# EAGLE schematic xio2 (EAGLE 9.2.2), part 2 of 2
## Sheet 16 of 19: FPGA Bank 14
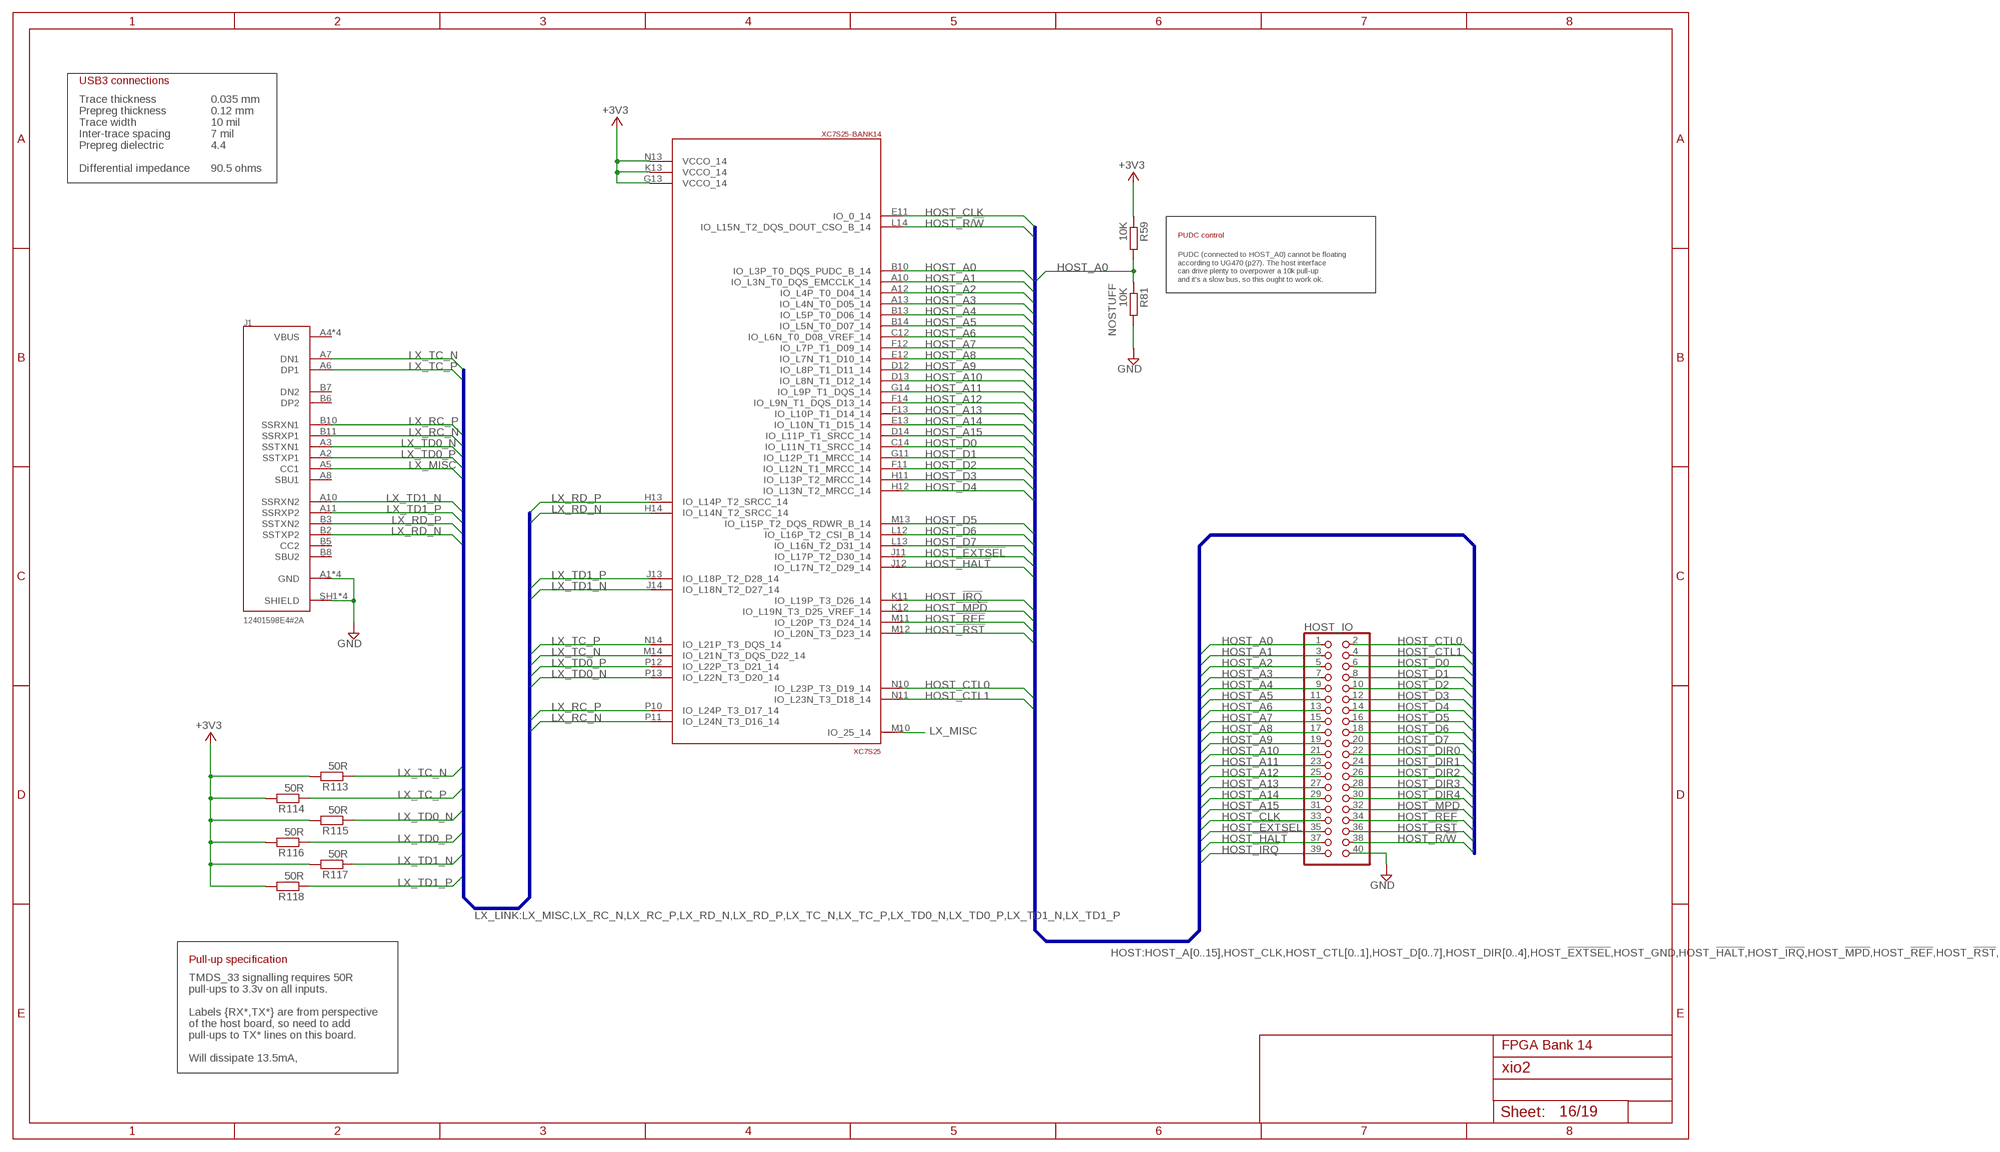
[diagram p15: schematic, sheet 16]

### Parts
HOST_IO  PINHD-2X20/90  [2X20/90]
J1  12401598E4#2A  [AMPHENOL_12401598E4#2A]
R59  10K  R-EU_R0201  [R0201]
R81  10K  R-EU_R0201  [R0201]
R113  50R  R-EU_R0201  [R0201]
R114  50R  R-EU_R0201  [R0201]
R115  50R  R-EU_R0201  [R0201]
R116  50R  R-EU_R0201  [R0201]
R117  50R  R-EU_R0201  [R0201]
R118  50R  R-EU_R0201  [R0201]

### Nets
+3V3 [lcd]: R59.1 R113.2 R114.2 R115.2 R116.2 R117.2 R118.2 XC7S25.G13(-BANK14:VCCO_14) XC7S25.K13(-BANK14:VCCO_14) XC7S25.N13(-BANK14:VCCO_14) ; also sheet 2,4,5,6,7,9,10,11,12,13,14,15,17,18,19
GND: HOST_IO.40 J1.A1(GND) J1.A12(GND) J1.B1(GND) J1.B12(GND) J1.SH1(SHIELD) J1.SH2(SHIELD) J1.SH3(SHIELD) J1.SH4(SHIELD) R81.2 ; also sheet 2,4,5,6,7,8,9,10,11,12,13,14,15,17,18,19
HOST_!EXTSEL!: HOST_IO.35 XC7S25.J11(-BANK14:IO_L17P_T2_D30_14) ; also sheet 10,11,12
HOST_!HALT!: HOST_IO.37 XC7S25.J12(-BANK14:IO_L17N_T2_D29_14) ; also sheet 10,11,12
HOST_!IRQ!: HOST_IO.39 XC7S25.K11(-BANK14:IO_L19P_T3_D26_14) ; also sheet 10,11,12
HOST_!MPD!: HOST_IO.32 XC7S25.K12(-BANK14:IO_L19N_T3_D25_VREF_14) ; also sheet 10,11,12
HOST_!REF!: HOST_IO.34 XC7S25.M11(-BANK14:IO_L20P_T3_D24_14) ; also sheet 10,11,12
HOST_!RST!: HOST_IO.36 XC7S25.M12(-BANK14:IO_L20N_T3_D23_14) ; also sheet 10,11,12
HOST_A0: HOST_IO.1 R59.2 R81.1 XC7S25.B10(-BANK14:IO_L3P_T0_DQS_PUDC_B_14) ; also sheet 3,10,11,12,18
HOST_A1: HOST_IO.3 XC7S25.A10(-BANK14:IO_L3N_T0_DQS_EMCCLK_14) ; also sheet 3,10,11,12,18
HOST_A2: HOST_IO.5 XC7S25.A12(-BANK14:IO_L4P_T0_D04_14) ; also sheet 3,10,11,12,18
HOST_A3: HOST_IO.7 XC7S25.A13(-BANK14:IO_L4N_T0_D05_14) ; also sheet 3,10,11,12,18
HOST_A4: HOST_IO.9 XC7S25.B13(-BANK14:IO_L5P_T0_D06_14) ; also sheet 3,10,11,12,18
HOST_A5: HOST_IO.11 XC7S25.B14(-BANK14:IO_L5N_T0_D07_14) ; also sheet 3,10,11,12,18
HOST_A6: HOST_IO.13 XC7S25.C12(-BANK14:IO_L6N_T0_D08_VREF_14) ; also sheet 3,10,11,12,18
HOST_A7: HOST_IO.15 XC7S25.F12(-BANK14:IO_L7P_T1_D09_14) ; also sheet 3,10,11,12,18
HOST_A8: HOST_IO.17 XC7S25.E12(-BANK14:IO_L7N_T1_D10_14) ; also sheet 3,10,11,12,18
HOST_A9: HOST_IO.19 XC7S25.D12(-BANK14:IO_L8P_T1_D11_14) ; also sheet 3,10,11,12,18
HOST_A10: HOST_IO.21 XC7S25.D13(-BANK14:IO_L8N_T1_D12_14) ; also sheet 3,10,11,12,18
HOST_A11: HOST_IO.23 XC7S25.G14(-BANK14:IO_L9P_T1_DQS_14) ; also sheet 3,10,11,12,18
HOST_A12: HOST_IO.25 XC7S25.F14(-BANK14:IO_L9N_T1_DQS_D13_14) ; also sheet 3,10,11,12,18
HOST_A13: HOST_IO.27 XC7S25.F13(-BANK14:IO_L10P_T1_D14_14) ; also sheet 3,10,11,12
HOST_A14: HOST_IO.29 XC7S25.E13(-BANK14:IO_L10N_T1_D15_14) ; also sheet 3,10,11,12
HOST_A15: HOST_IO.31 XC7S25.D14(-BANK14:IO_L11P_T1_SRCC_14) ; also sheet 3,10,11,12
HOST_CLK: HOST_IO.33 XC7S25.E11(-BANK14:IO_0_14) ; also sheet 10,11,12,18
HOST_CTL0: HOST_IO.2 XC7S25.N10(-BANK14:IO_L23P_T3_D19_14)
HOST_CTL1: HOST_IO.4 XC7S25.N11(-BANK14:IO_L23N_T3_D18_14)
HOST_D0: HOST_IO.6 XC7S25.C14(-BANK14:IO_L11N_T1_SRCC_14) ; also sheet 10,11,12,18
HOST_D1: HOST_IO.8 XC7S25.G11(-BANK14:IO_L12P_T1_MRCC_14) ; also sheet 10,11,12,18
HOST_D2: HOST_IO.10 XC7S25.F11(-BANK14:IO_L12N_T1_MRCC_14) ; also sheet 10,11,12,18
HOST_D3: HOST_IO.12 XC7S25.H11(-BANK14:IO_L13P_T2_MRCC_14) ; also sheet 10,11,12,18
HOST_D4: HOST_IO.14 XC7S25.H12(-BANK14:IO_L13N_T2_MRCC_14) ; also sheet 10,11,12,18
HOST_D5: HOST_IO.16 XC7S25.M13(-BANK14:IO_L15P_T2_DQS_RDWR_B_14) ; also sheet 10,11,12,18
HOST_D6: HOST_IO.18 XC7S25.L12(-BANK14:IO_L16P_T2_CSI_B_14) ; also sheet 10,11,12,18
HOST_D7: HOST_IO.20 XC7S25.L13(-BANK14:IO_L16N_T2_D31_14) ; also sheet 10,11,12,18
HOST_DIR0: HOST_IO.22 ; also sheet 17,18
HOST_DIR1: HOST_IO.24 ; also sheet 17
HOST_DIR2: HOST_IO.26 ; also sheet 17
HOST_DIR3: HOST_IO.28 ; also sheet 17
HOST_DIR4: HOST_IO.30 ; also sheet 17
HOST_R/!W!: HOST_IO.38 XC7S25.L14(-BANK14:IO_L15N_T2_DQS_DOUT_CSO_B_14) ; also sheet 10,11,12,18
LX_MISC: J1.A5(CC1) XC7S25.M10(-BANK14:IO_25_14)
LX_RC_N [usb90]: J1.B11(SSRXP1) XC7S25.P11(-BANK14:IO_L24N_T3_D16_14)
LX_RC_P [usb90]: J1.B10(SSRXN1) XC7S25.P10(-BANK14:IO_L24P_T3_D17_14)
LX_RD_N [usb90]: J1.B2(SSTXP2) XC7S25.H14(-BANK14:IO_L14N_T2_SRCC_14)
LX_RD_P [usb90]: J1.B3(SSTXN2) XC7S25.H13(-BANK14:IO_L14P_T2_SRCC_14)
LX_TC_N [usb90]: J1.A7(DN1) R113.1 XC7S25.M14(-BANK14:IO_L21N_T3_DQS_D22_14)
LX_TC_P [usb90]: J1.A6(DP1) R114.1 XC7S25.N14(-BANK14:IO_L21P_T3_DQS_14)
LX_TD0_N [usb90]: J1.A3(SSTXN1) R115.1 XC7S25.P13(-BANK14:IO_L22N_T3_D20_14)
LX_TD0_P [usb90]: J1.A2(SSTXP1) R116.1 XC7S25.P12(-BANK14:IO_L22P_T3_D21_14)
LX_TD1_N [usb90]: J1.A10(SSRXN2) R117.1 XC7S25.J14(-BANK14:IO_L18N_T2_D27_14)
LX_TD1_P [usb90]: J1.A11(SSRXP2) R118.1 XC7S25.J13(-BANK14:IO_L18P_T2_D28_14)
Unconnected: J1.A4(VBUS) J1.A8(SBU1) J1.A9(VBUS) J1.B4(VBUS) J1.B5(CC2) J1.B6(DP2) J1.B7(DN2) J1.B8(SBU2) J1.B9(VBUS)

### Buses
LX_LINK:LX_MISC,LX_RC_N,LX_RC_P,LX_RD_N,LX_RD_P,LX_TC_N,LX_TC_P,LX_TD0_N,LX_TD0_P,LX_TD1_N,LX_TD1_P
LX_RC_N,LX_RC_P,LX_RD_N,LX_RD_P,LX_TC_N,LX_TC_P,LX_TD0_N,LX_TD0_P,LX_TD1_N,LX_TD1_P
HOST:HOST_A[0..15],HOST_CLK,HOST_CTL[0..1],HOST_D[0..7],HOST_DIR[0..4],HOST_!EXTSEL!,HOST_GND,HOST_!HALT!,HOST_!IRQ!,HOST_!MPD!,HOST_!REF!,HOST_!RST!,HOST_R/!W!

### Notes on the sheet
- USB3 connections
- Trace thickness
  Prepreg thickness
  Trace width
  Inter-trace spacing
  Prepreg dielectric
  
  Differential impedance
- 0.035 mm
  0.12 mm
  10 mil
  7 mil
  4.4
  
  90.5 ohms
- PUDC control
- PUDC (connected to HOST_A0) cannot be floating
  according to UG470 (p27). The host interface
  can drive plenty to overpower a 10k pull-up
  and it's a slow bus, so this ought to work ok.
- Pull-up specification
- FPGA Bank 14
- TMDS_33 signalling requires 50R
  pull-ups to 3.3v on all inputs.
  
  Labels {RX*,TX*} are from perspective
  of the host board, so need to add
  pull-ups to TX* lines on this board.
  
  Will dissipate 13.5mA,

## Sheet 17 of 19: FPGA Bank 34
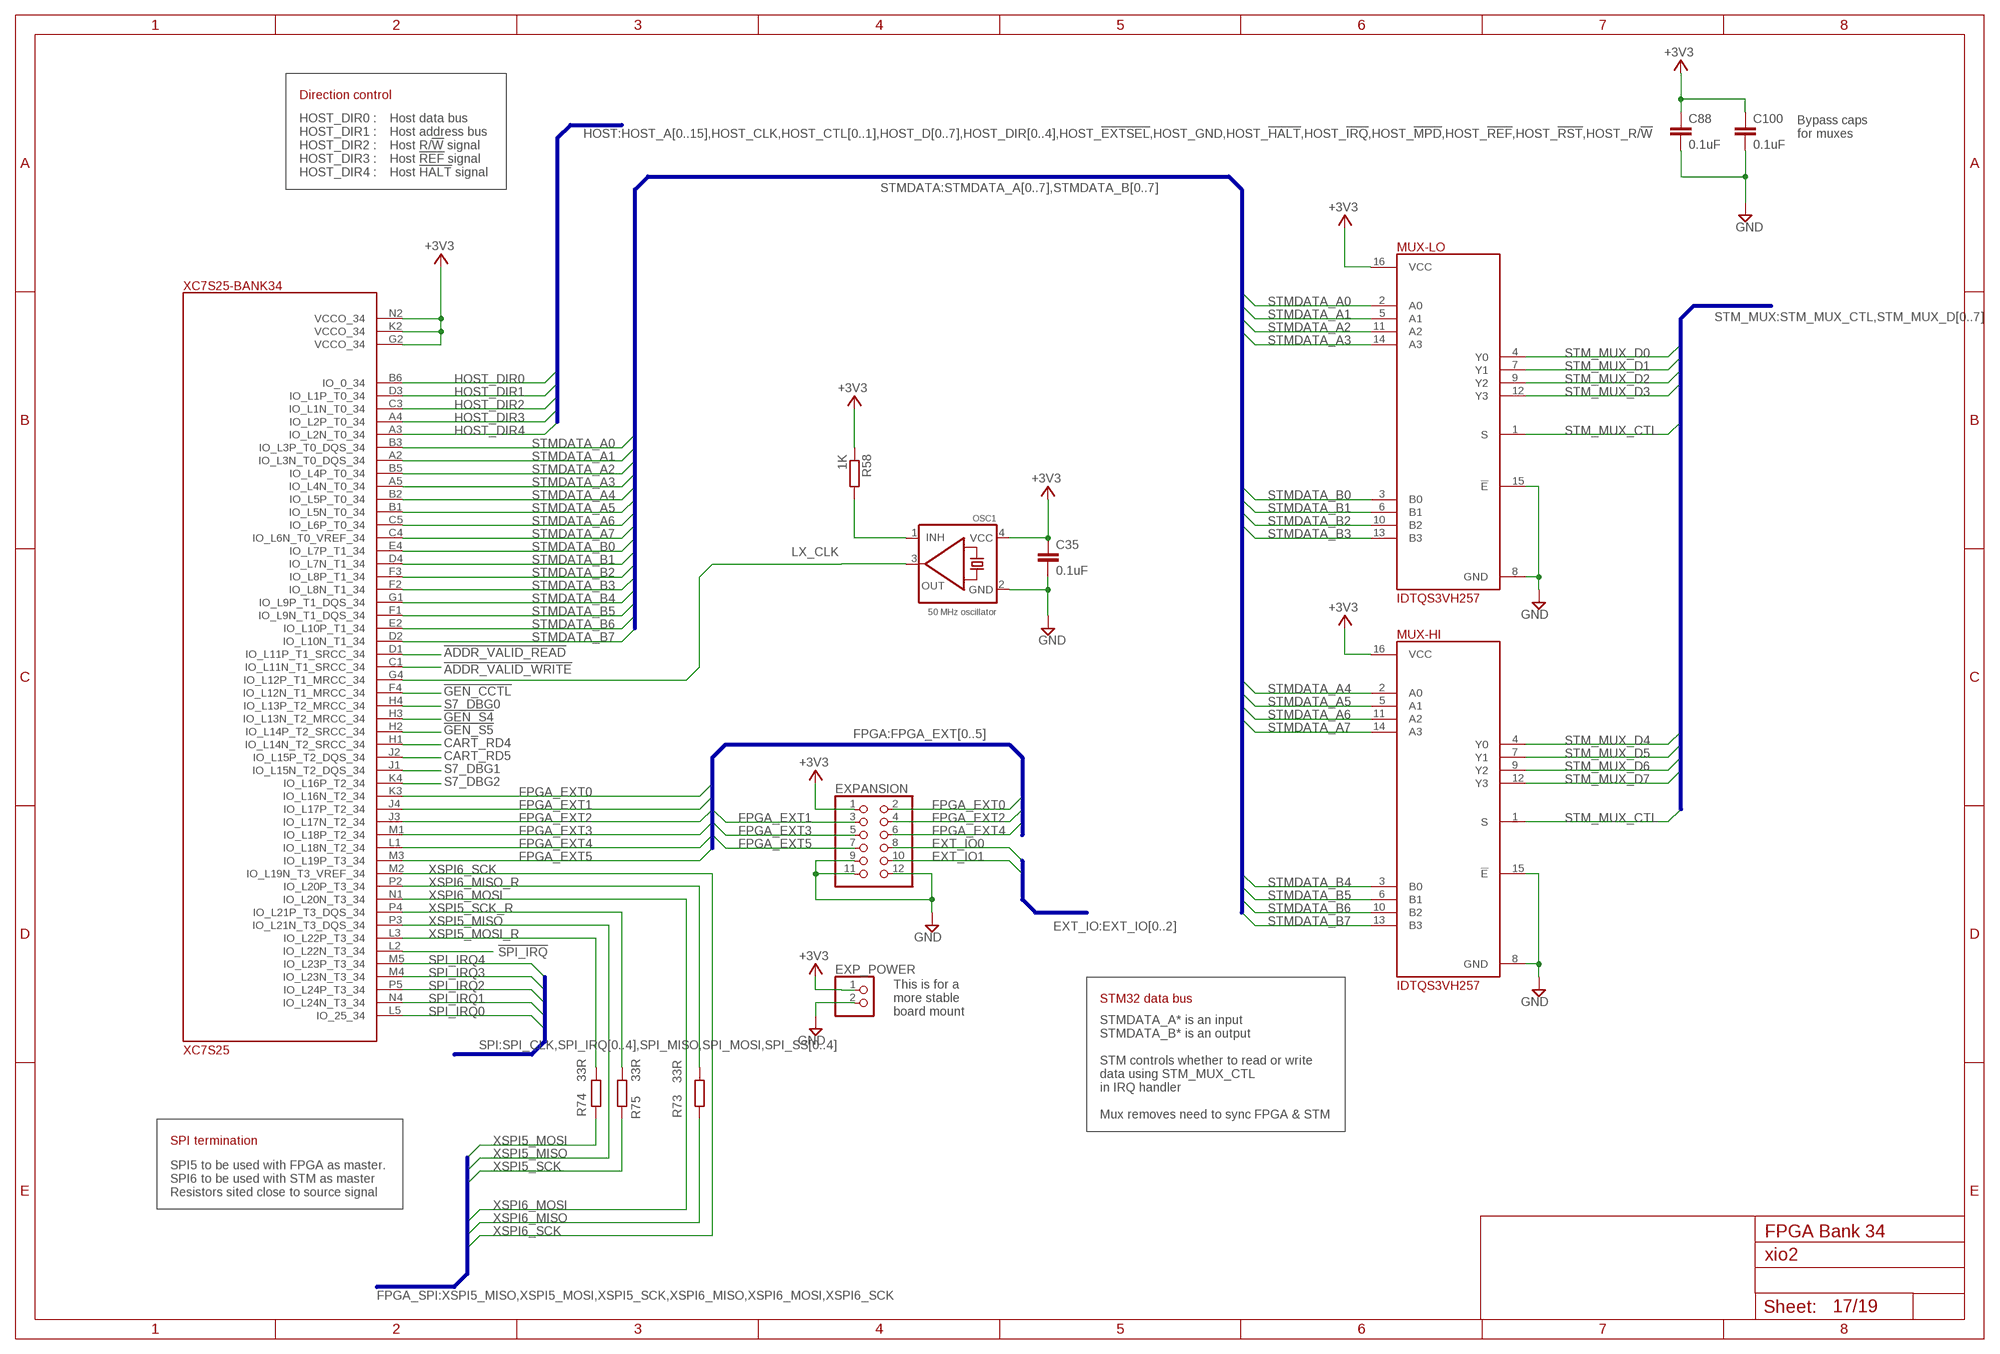
[diagram p16: schematic, sheet 17]

### Parts
C35  0.1uF  C-EUC0201  [C0201]
C88  0.1uF  C-EUC0201  [C0201]
C100  0.1uF  C-EUC0201  [C0201]
EXP_POWER  PINHD-1X2  [1X02]
EXPANSION  PINHD-2X6  [2X06]
MUX-HI  IDTQS3VH257  [SO16]
MUX-LO  IDTQS3VH257  [SO16]
OSC1  50 MHz oscillator  OSCILLATOR3.2X2.5  [OSC_3.2X2.5MM]
R58  1K  R-EU_R0201  [R0201]
R73  33R  R-EU_R0201  [R0201]
R74  33R  R-EU_R0201  [R0201]
R75  33R  R-EU_R0201  [R0201]

### Nets
!ADDR_VALID_READ!: XC7S25.D1(-BANK34:IO_L11P_T1_SRCC_34) ; also sheet 3
!ADDR_VALID_WRITE!: XC7S25.C1(-BANK34:IO_L11N_T1_SRCC_34) ; also sheet 3
!GEN_CCTL!: XC7S25.F4(-BANK34:IO_L12N_T1_MRCC_34) ; also sheet 18
!GEN_S4!: XC7S25.H3(-BANK34:IO_L13N_T2_MRCC_34) ; also sheet 18
!GEN_S5!: XC7S25.H2(-BANK34:IO_L14P_T2_SRCC_34) ; also sheet 18
!SPI_IRQ! [spi]: XC7S25.L2(-BANK34:IO_L22N_T3_34) ; also sheet 3
+3V3 [lcd]: C35.1 C88.1 C100.1 EXP_POWER.1 EXPANSION.1 MUX-HI.16(VCC) MUX-LO.16(VCC) OSC1.4(VCC) R58.1 XC7S25.G2(-BANK34:VCCO_34) XC7S25.K2(-BANK34:VCCO_34) XC7S25.N2(-BANK34:VCCO_34) ; also sheet 2,4,5,6,7,9,10,11,12,13,14,15,16,18,19
CART_RD4: XC7S25.H1(-BANK34:IO_L14N_T2_SRCC_34) ; also sheet 18
CART_RD5: XC7S25.J2(-BANK34:IO_L15P_T2_DQS_34) ; also sheet 18
EXT_IO0: EXPANSION.8 ; also sheet 6
EXT_IO1: EXPANSION.10 ; also sheet 6
FPGA_EXT0: EXPANSION.2 XC7S25.K3(-BANK34:IO_L16N_T2_34)
FPGA_EXT1: EXPANSION.3 XC7S25.J4(-BANK34:IO_L17P_T2_34)
FPGA_EXT2: EXPANSION.4 XC7S25.J3(-BANK34:IO_L17N_T2_34)
FPGA_EXT3: EXPANSION.5 XC7S25.M1(-BANK34:IO_L18P_T2_34)
FPGA_EXT4: EXPANSION.6 XC7S25.L1(-BANK34:IO_L18N_T2_34)
FPGA_EXT5: EXPANSION.7 XC7S25.M3(-BANK34:IO_L19P_T3_34)
GND: C35.2 C88.2 C100.2 EXP_POWER.2 EXPANSION.9 EXPANSION.11 EXPANSION.12 MUX-HI.8(GND) MUX-HI.15(!E!) MUX-LO.8(GND) MUX-LO.15(!E!) OSC1.2(GND) ; also sheet 2,4,5,6,7,8,9,10,11,12,13,14,15,16,18,19
HOST_DIR0: XC7S25.B6(-BANK34:IO_0_34) ; also sheet 16,18
HOST_DIR1: XC7S25.D3(-BANK34:IO_L1P_T0_34) ; also sheet 16
HOST_DIR2: XC7S25.C3(-BANK34:IO_L1N_T0_34) ; also sheet 16
HOST_DIR3: XC7S25.A4(-BANK34:IO_L2P_T0_34) ; also sheet 16
HOST_DIR4: XC7S25.A3(-BANK34:IO_L2N_T0_34) ; also sheet 16
LX_CLK [clock]: OSC1.3(OUT) XC7S25.G4(-BANK34:IO_L12P_T1_MRCC_34)
N$5: OSC1.1(INH) R58.2
S7_DBG0: XC7S25.H4(-BANK34:IO_L13P_T2_MRCC_34) ; also sheet 19
S7_DBG1: XC7S25.J1(-BANK34:IO_L15N_T2_DQS_34) ; also sheet 19
S7_DBG2: XC7S25.K4(-BANK34:IO_L16P_T2_34) ; also sheet 19
SPI_IRQ0 [spi]: XC7S25.L5(-BANK34:IO_25_34) ; also sheet 3,10
SPI_IRQ1 [spi]: XC7S25.N4(-BANK34:IO_L24N_T3_34) ; also sheet 3,10
SPI_IRQ2 [spi]: XC7S25.P5(-BANK34:IO_L24P_T3_34) ; also sheet 3,11
SPI_IRQ3 [spi]: XC7S25.M4(-BANK34:IO_L23N_T3_34) ; also sheet 3,11
SPI_IRQ4 [spi]: XC7S25.M5(-BANK34:IO_L23P_T3_34) ; also sheet 3,12
STM_MUX_CTL: MUX-HI.1(S) MUX-LO.1(S) ; also sheet 3
STM_MUX_D0: MUX-LO.4(Y0) ; also sheet 3
STM_MUX_D1: MUX-LO.7(Y1) ; also sheet 3
STM_MUX_D2: MUX-LO.9(Y2) ; also sheet 3
STM_MUX_D3: MUX-LO.12(Y3) ; also sheet 3
STM_MUX_D4: MUX-HI.4(Y0) ; also sheet 3
STM_MUX_D5: MUX-HI.7(Y1) ; also sheet 3
STM_MUX_D6: MUX-HI.9(Y2) ; also sheet 3
STM_MUX_D7: MUX-HI.12(Y3) ; also sheet 3
STMDATA_A0: MUX-LO.2(A0) XC7S25.B3(-BANK34:IO_L3P_T0_DQS_34)
STMDATA_A1: MUX-LO.5(A1) XC7S25.A2(-BANK34:IO_L3N_T0_DQS_34)
STMDATA_A2: MUX-LO.11(A2) XC7S25.B5(-BANK34:IO_L4P_T0_34)
STMDATA_A3: MUX-LO.14(A3) XC7S25.A5(-BANK34:IO_L4N_T0_34)
STMDATA_A4: MUX-HI.2(A0) XC7S25.B2(-BANK34:IO_L5P_T0_34)
STMDATA_A5: MUX-HI.5(A1) XC7S25.B1(-BANK34:IO_L5N_T0_34)
STMDATA_A6: MUX-HI.11(A2) XC7S25.C5(-BANK34:IO_L6P_T0_34)
STMDATA_A7: MUX-HI.14(A3) XC7S25.C4(-BANK34:IO_L6N_T0_VREF_34)
STMDATA_B0: MUX-LO.3(B0) XC7S25.E4(-BANK34:IO_L7P_T1_34)
STMDATA_B1: MUX-LO.6(B1) XC7S25.D4(-BANK34:IO_L7N_T1_34)
STMDATA_B2: MUX-LO.10(B2) XC7S25.F3(-BANK34:IO_L8P_T1_34)
STMDATA_B3: MUX-LO.13(B3) XC7S25.F2(-BANK34:IO_L8N_T1_34)
STMDATA_B4: MUX-HI.3(B0) XC7S25.G1(-BANK34:IO_L9P_T1_DQS_34)
STMDATA_B5: MUX-HI.6(B1) XC7S25.F1(-BANK34:IO_L9N_T1_DQS_34)
STMDATA_B6: MUX-HI.10(B2) XC7S25.E2(-BANK34:IO_L10P_T1_34)
STMDATA_B7: MUX-HI.13(B3) XC7S25.D2(-BANK34:IO_L10N_T1_34)
XSPI5_MISO [xspi5]: XC7S25.P3(-BANK34:IO_L21N_T3_DQS_34) ; also sheet 3
XSPI5_MOSI [xspi5]: R74.1 ; also sheet 3
XSPI5_MOSI_R [spi]: R74.2 XC7S25.L3(-BANK34:IO_L22P_T3_34)
XSPI5_SCK [xspi5]: R75.1 ; also sheet 3
XSPI5_SCK_R [spi]: R75.2 XC7S25.P4(-BANK34:IO_L21P_T3_DQS_34)
XSPI6_MISO [xspi6]: R73.1 ; also sheet 3
XSPI6_MISO_R [spi]: R73.2 XC7S25.P2(-BANK34:IO_L20P_T3_34)
XSPI6_MOSI [xspi6]: XC7S25.N1(-BANK34:IO_L20N_T3_34) ; also sheet 3
XSPI6_SCK [xspi6]: XC7S25.M2(-BANK34:IO_L19N_T3_VREF_34) ; also sheet 3

### Buses
HOST:HOST_A[0..15],HOST_CLK,HOST_CTL[0..1],HOST_D[0..7],HOST_DIR[0..4],HOST_!EXTSEL!,HOST_GND,HOST_!HALT!,HOST_!IRQ!,HOST_!MPD!,HOST_!REF!,HOST_!RST!,HOST_R/!W!
STMDATA:STMDATA_A[0..7],STMDATA_B[0..7]
STM_MUX:STM_MUX_CTL,STM_MUX_D[0..7]
SPI:SPI_CLK,SPI_IRQ[0..4],SPI_MISO,SPI_MOSI,SPI_SS[0..4]
FPGA:FPGA_EXT[0..5]
EXT_IO:EXT_IO[0..2]
FPGA_SPI:XSPI5_MISO,XSPI5_MOSI,XSPI5_SCK,XSPI6_MISO,XSPI6_MOSI,XSPI6_SCK

### Notes on the sheet
- Direction control
- Bypass caps
  for muxes
- HOST_DIR0 :
  HOST_DIR1 :
  HOST_DIR2 :
  HOST_DIR3 :
  HOST_DIR4 :
- Host data bus
  Host address bus
  Host R/!W! signal
  Host !REF! signal
  Host !HALT! signal
- STM32 data bus
- This is for a
  more stable
  board mount
- STMDATA_A* is an input
  STMDATA_B* is an output
  
  STM controls whether to read or write
  data using STM_MUX_CTL
  in IRQ handler
  
  Mux removes need to sync FPGA & STM
- SPI termination
- SPI5 to be used with FPGA as master. 
  SPI6 to be used with STM as master
  Resistors sited close to source signal
- FPGA Bank 34

## Sheet 18 of 19: Cartridge port
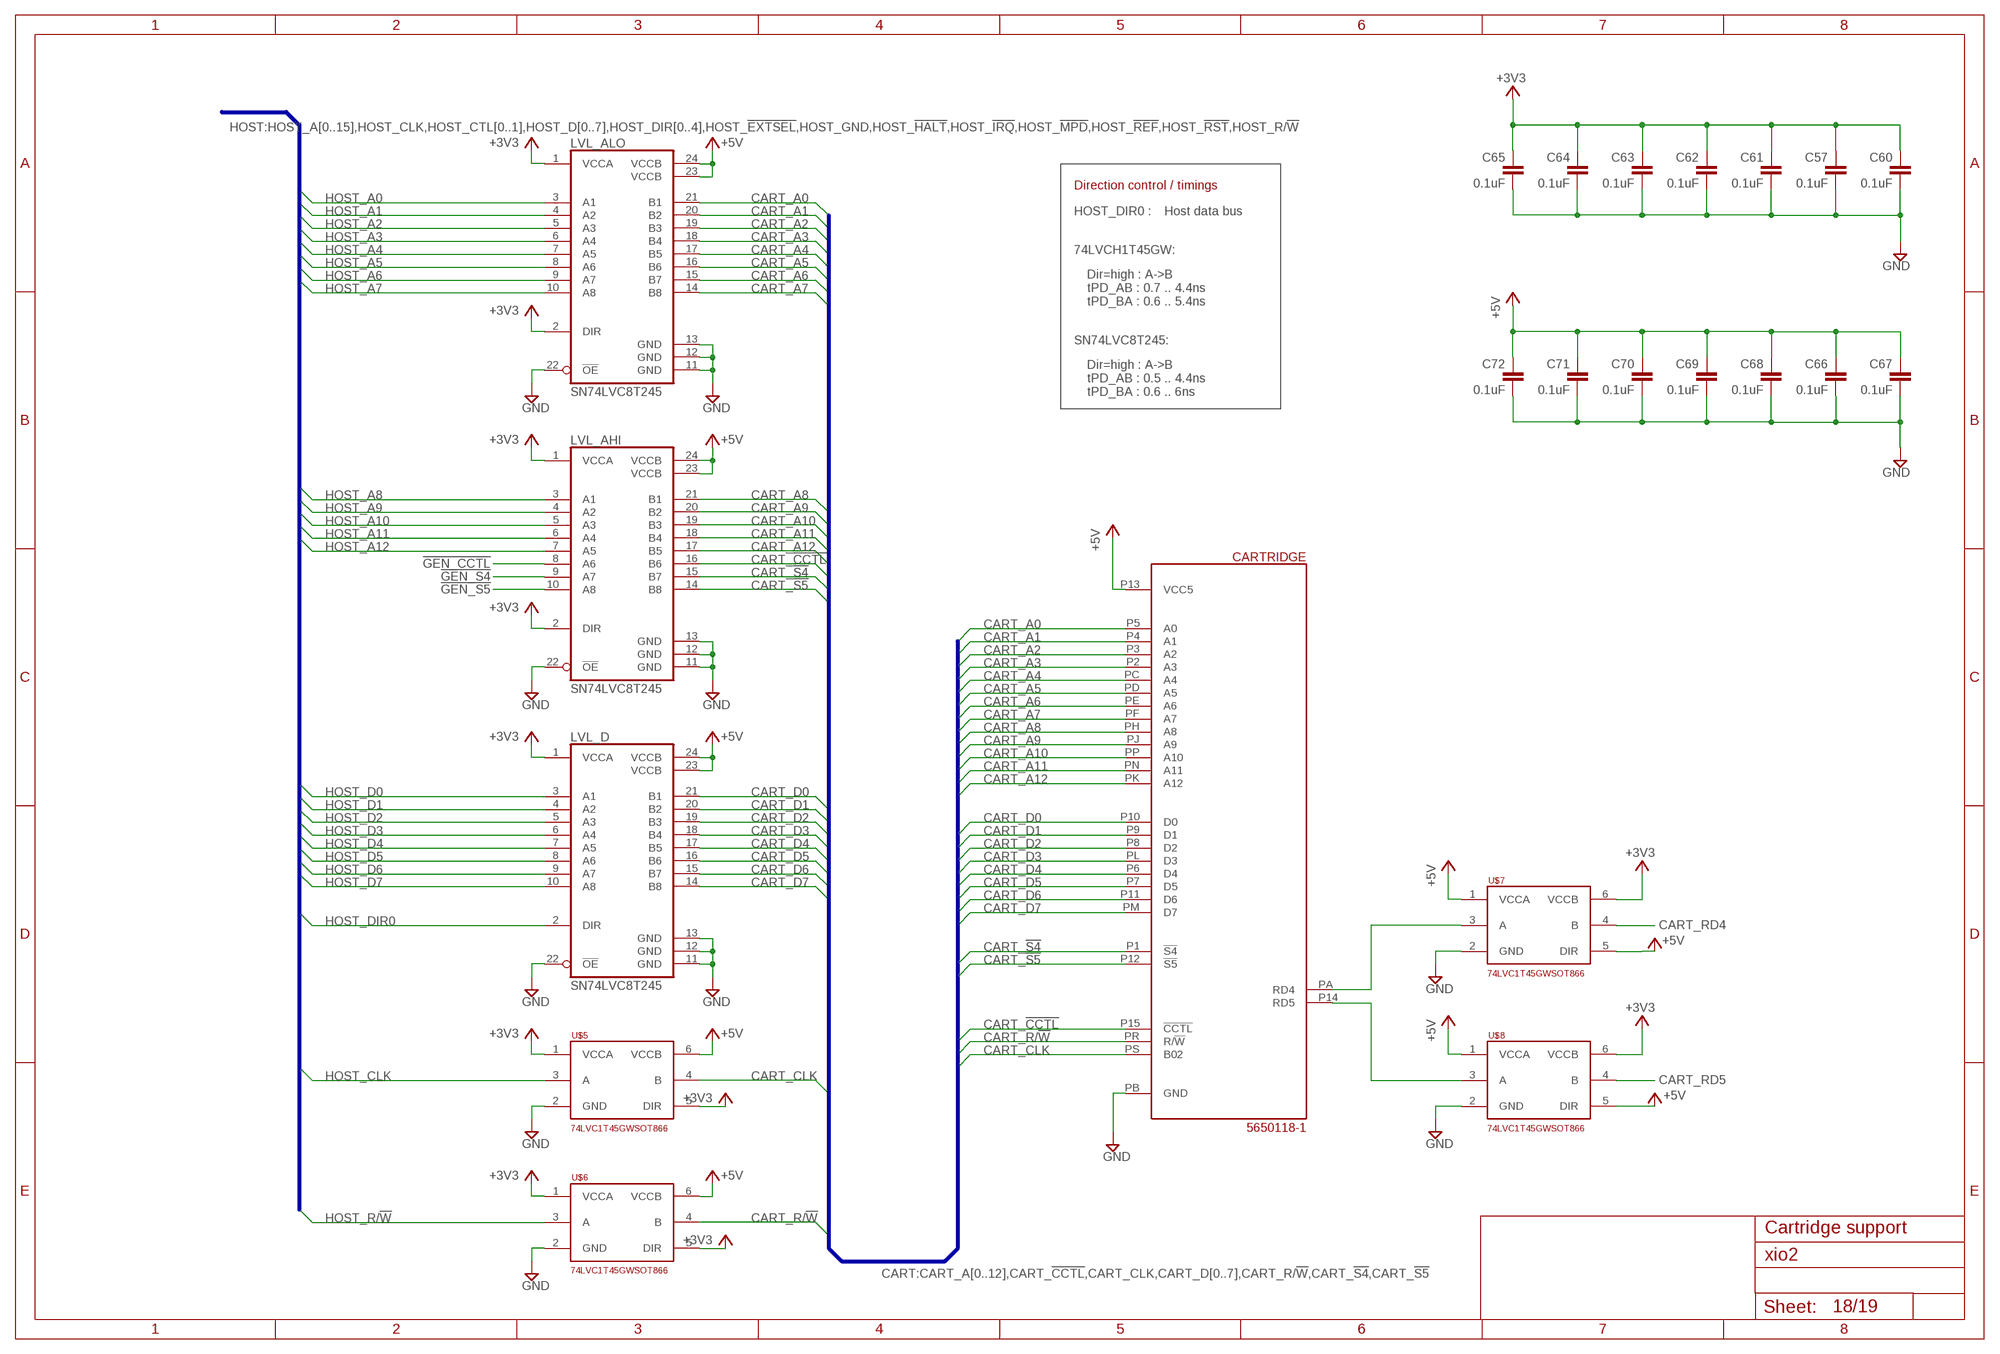
[diagram p17: schematic, sheet 18]

### Parts
C57  0.1uF  C-EUC0201  [C0201]
C60  0.1uF  C-EUC0201  [C0201]
C61  0.1uF  C-EUC0201  [C0201]
C62  0.1uF  C-EUC0201  [C0201]
C63  0.1uF  C-EUC0201  [C0201]
C64  0.1uF  C-EUC0201  [C0201]
C65  0.1uF  C-EUC0201  [C0201]
C66  0.1uF  C-EUC0201  [C0201]
C67  0.1uF  C-EUC0201  [C0201]
C68  0.1uF  C-EUC0201  [C0201]
C69  0.1uF  C-EUC0201  [C0201]
C70  0.1uF  C-EUC0201  [C0201]
C71  0.1uF  C-EUC0201  [C0201]
C72  0.1uF  C-EUC0201  [C0201]
CARTRIDGE  5650118-1  A8_CART  [A8_CART]
LVL_AHI  SN74LVC8T245  [TSSOP24]
LVL_ALO  SN74LVC8T245  [TSSOP24]
LVL_D  SN74LVC8T245  [TSSOP24]
U$5  74LVC1T45GWSOT866  [SOT886]
U$6  74LVC1T45GWSOT866  [SOT886]
U$7  74LVC1T45GWSOT866  [SOT886]
U$8  74LVC1T45GWSOT866  [SOT886]

### Nets
!GEN_CCTL!: LVL_AHI.8(A6) ; also sheet 17
!GEN_S4!: LVL_AHI.9(A7) ; also sheet 17
!GEN_S5!: LVL_AHI.10(A8) ; also sheet 17
+3V3 [lcd]: C57.1 C60.1 C61.1 C62.1 C63.1 C64.1 C65.1 LVL_AHI.1(VCCA) LVL_AHI.2(DIR) LVL_ALO.1(VCCA) LVL_ALO.2(DIR) LVL_D.1(VCCA) U$5.1(VCCA) U$5.5(DIR) U$6.1(VCCA) U$6.5(DIR) U$7.6(VCCB) U$8.6(VCCB) ; also sheet 2,4,5,6,7,9,10,11,12,13,14,15,16,17,19
+5V [Power]: C66.1 C67.1 C68.1 C69.1 C70.1 C71.1 C72.1 CARTRIDGE.P13(VCC5) LVL_AHI.23(VCCB) LVL_AHI.24(VCCB) LVL_ALO.23(VCCB) LVL_ALO.24(VCCB) LVL_D.23(VCCB) LVL_D.24(VCCB) U$5.6(VCCB) U$6.6(VCCB) U$7.1(VCCA) U$7.5(DIR) U$8.1(VCCA) U$8.5(DIR) ; also sheet 2,7,8,9,10,11,12,13,19
CART_!CCTL!: CARTRIDGE.P15(!CCTL!) LVL_AHI.16(B6)
CART_!S4!: CARTRIDGE.P1(!S4!) LVL_AHI.15(B7)
CART_!S5!: CARTRIDGE.P12(!S5!) LVL_AHI.14(B8)
CART_A0: CARTRIDGE.P5(A0) LVL_ALO.21(B1)
CART_A1: CARTRIDGE.P4(A1) LVL_ALO.20(B2)
CART_A2: CARTRIDGE.P3(A2) LVL_ALO.19(B3)
CART_A3: CARTRIDGE.P2(A3) LVL_ALO.18(B4)
CART_A4: CARTRIDGE.PC(A4) LVL_ALO.17(B5)
CART_A5: CARTRIDGE.PD(A5) LVL_ALO.16(B6)
CART_A6: CARTRIDGE.PE(A6) LVL_ALO.15(B7)
CART_A7: CARTRIDGE.PF(A7) LVL_ALO.14(B8)
CART_A8: CARTRIDGE.PH(A8) LVL_AHI.21(B1)
CART_A9: CARTRIDGE.PJ(A9) LVL_AHI.20(B2)
CART_A10: CARTRIDGE.PP(A10) LVL_AHI.19(B3)
CART_A11: CARTRIDGE.PN(A11) LVL_AHI.18(B4)
CART_A12: CARTRIDGE.PK(A12) LVL_AHI.17(B5)
CART_CLK: CARTRIDGE.PS(B02) U$5.4(B)
CART_D0: CARTRIDGE.P10(D0) LVL_D.21(B1)
CART_D1: CARTRIDGE.P9(D1) LVL_D.20(B2)
CART_D2: CARTRIDGE.P8(D2) LVL_D.19(B3)
CART_D3: CARTRIDGE.PL(D3) LVL_D.18(B4)
CART_D4: CARTRIDGE.P6(D4) LVL_D.17(B5)
CART_D5: CARTRIDGE.P7(D5) LVL_D.16(B6)
CART_D6: CARTRIDGE.P11(D6) LVL_D.15(B7)
CART_D7: CARTRIDGE.PM(D7) LVL_D.14(B8)
CART_R/!W!: CARTRIDGE.PR(R/!W!) U$6.4(B)
CART_RD4: U$7.4(B) ; also sheet 17
CART_RD5: U$8.4(B) ; also sheet 17
GND: C57.2 C60.2 C61.2 C62.2 C63.2 C64.2 C65.2 C66.2 C67.2 C68.2 C69.2 C70.2 C71.2 C72.2 CARTRIDGE.PB(GND) LVL_AHI.11(GND) LVL_AHI.12(GND) LVL_AHI.13(GND) LVL_AHI.22(!OE!) LVL_ALO.11(GND) LVL_ALO.12(GND) LVL_ALO.13(GND) LVL_ALO.22(!OE!) LVL_D.11(GND) LVL_D.12(GND) LVL_D.13(GND) LVL_D.22(!OE!) U$5.2(GND) U$6.2(GND) U$7.2(GND) U$8.2(GND) ; also sheet 2,4,5,6,7,8,9,10,11,12,13,14,15,16,17,19
HOST_A0: LVL_ALO.3(A1) ; also sheet 3,10,11,12,16
HOST_A1: LVL_ALO.4(A2) ; also sheet 3,10,11,12,16
HOST_A2: LVL_ALO.5(A3) ; also sheet 3,10,11,12,16
HOST_A3: LVL_ALO.6(A4) ; also sheet 3,10,11,12,16
HOST_A4: LVL_ALO.7(A5) ; also sheet 3,10,11,12,16
HOST_A5: LVL_ALO.8(A6) ; also sheet 3,10,11,12,16
HOST_A6: LVL_ALO.9(A7) ; also sheet 3,10,11,12,16
HOST_A7: LVL_ALO.10(A8) ; also sheet 3,10,11,12,16
HOST_A8: LVL_AHI.3(A1) ; also sheet 3,10,11,12,16
HOST_A9: LVL_AHI.4(A2) ; also sheet 3,10,11,12,16
HOST_A10: LVL_AHI.5(A3) ; also sheet 3,10,11,12,16
HOST_A11: LVL_AHI.6(A4) ; also sheet 3,10,11,12,16
HOST_A12: LVL_AHI.7(A5) ; also sheet 3,10,11,12,16
HOST_CLK: U$5.3(A) ; also sheet 10,11,12,16
HOST_D0: LVL_D.3(A1) ; also sheet 10,11,12,16
HOST_D1: LVL_D.4(A2) ; also sheet 10,11,12,16
HOST_D2: LVL_D.5(A3) ; also sheet 10,11,12,16
HOST_D3: LVL_D.6(A4) ; also sheet 10,11,12,16
HOST_D4: LVL_D.7(A5) ; also sheet 10,11,12,16
HOST_D5: LVL_D.8(A6) ; also sheet 10,11,12,16
HOST_D6: LVL_D.9(A7) ; also sheet 10,11,12,16
HOST_D7: LVL_D.10(A8) ; also sheet 10,11,12,16
HOST_DIR0: LVL_D.2(DIR) ; also sheet 16,17
HOST_R/!W!: U$6.3(A) ; also sheet 10,11,12,16
N$58: CARTRIDGE.PA(RD4) U$7.3(A)
N$59: CARTRIDGE.P14(RD5) U$8.3(A)

### Buses
HOST:HOST_A[0..15],HOST_CLK,HOST_CTL[0..1],HOST_D[0..7],HOST_DIR[0..4],HOST_!EXTSEL!,HOST_GND,HOST_!HALT!,HOST_!IRQ!,HOST_!MPD!,HOST_!REF!,HOST_!RST!,HOST_R/!W!
CART:CART_A[0..12],CART_!CCTL!,CART_CLK,CART_D[0..7],CART_R/!W!,CART_!S4!,CART_!S5!

### Notes on the sheet
- Direction control / timings
- HOST_DIR0 : | Host data bus
- 74LVCH1T45GW:
- Dir=high : A->B
  tPD_AB : 0.7 .. 4.4ns
  tPD_BA : 0.6 .. 5.4ns
- SN74LVC8T245:
- Dir=high : A->B
  tPD_AB : 0.5 .. 4.4ns
  tPD_BA : 0.6 .. 6ns
- Cartridge support

## Sheet 19 of 19: LEDs
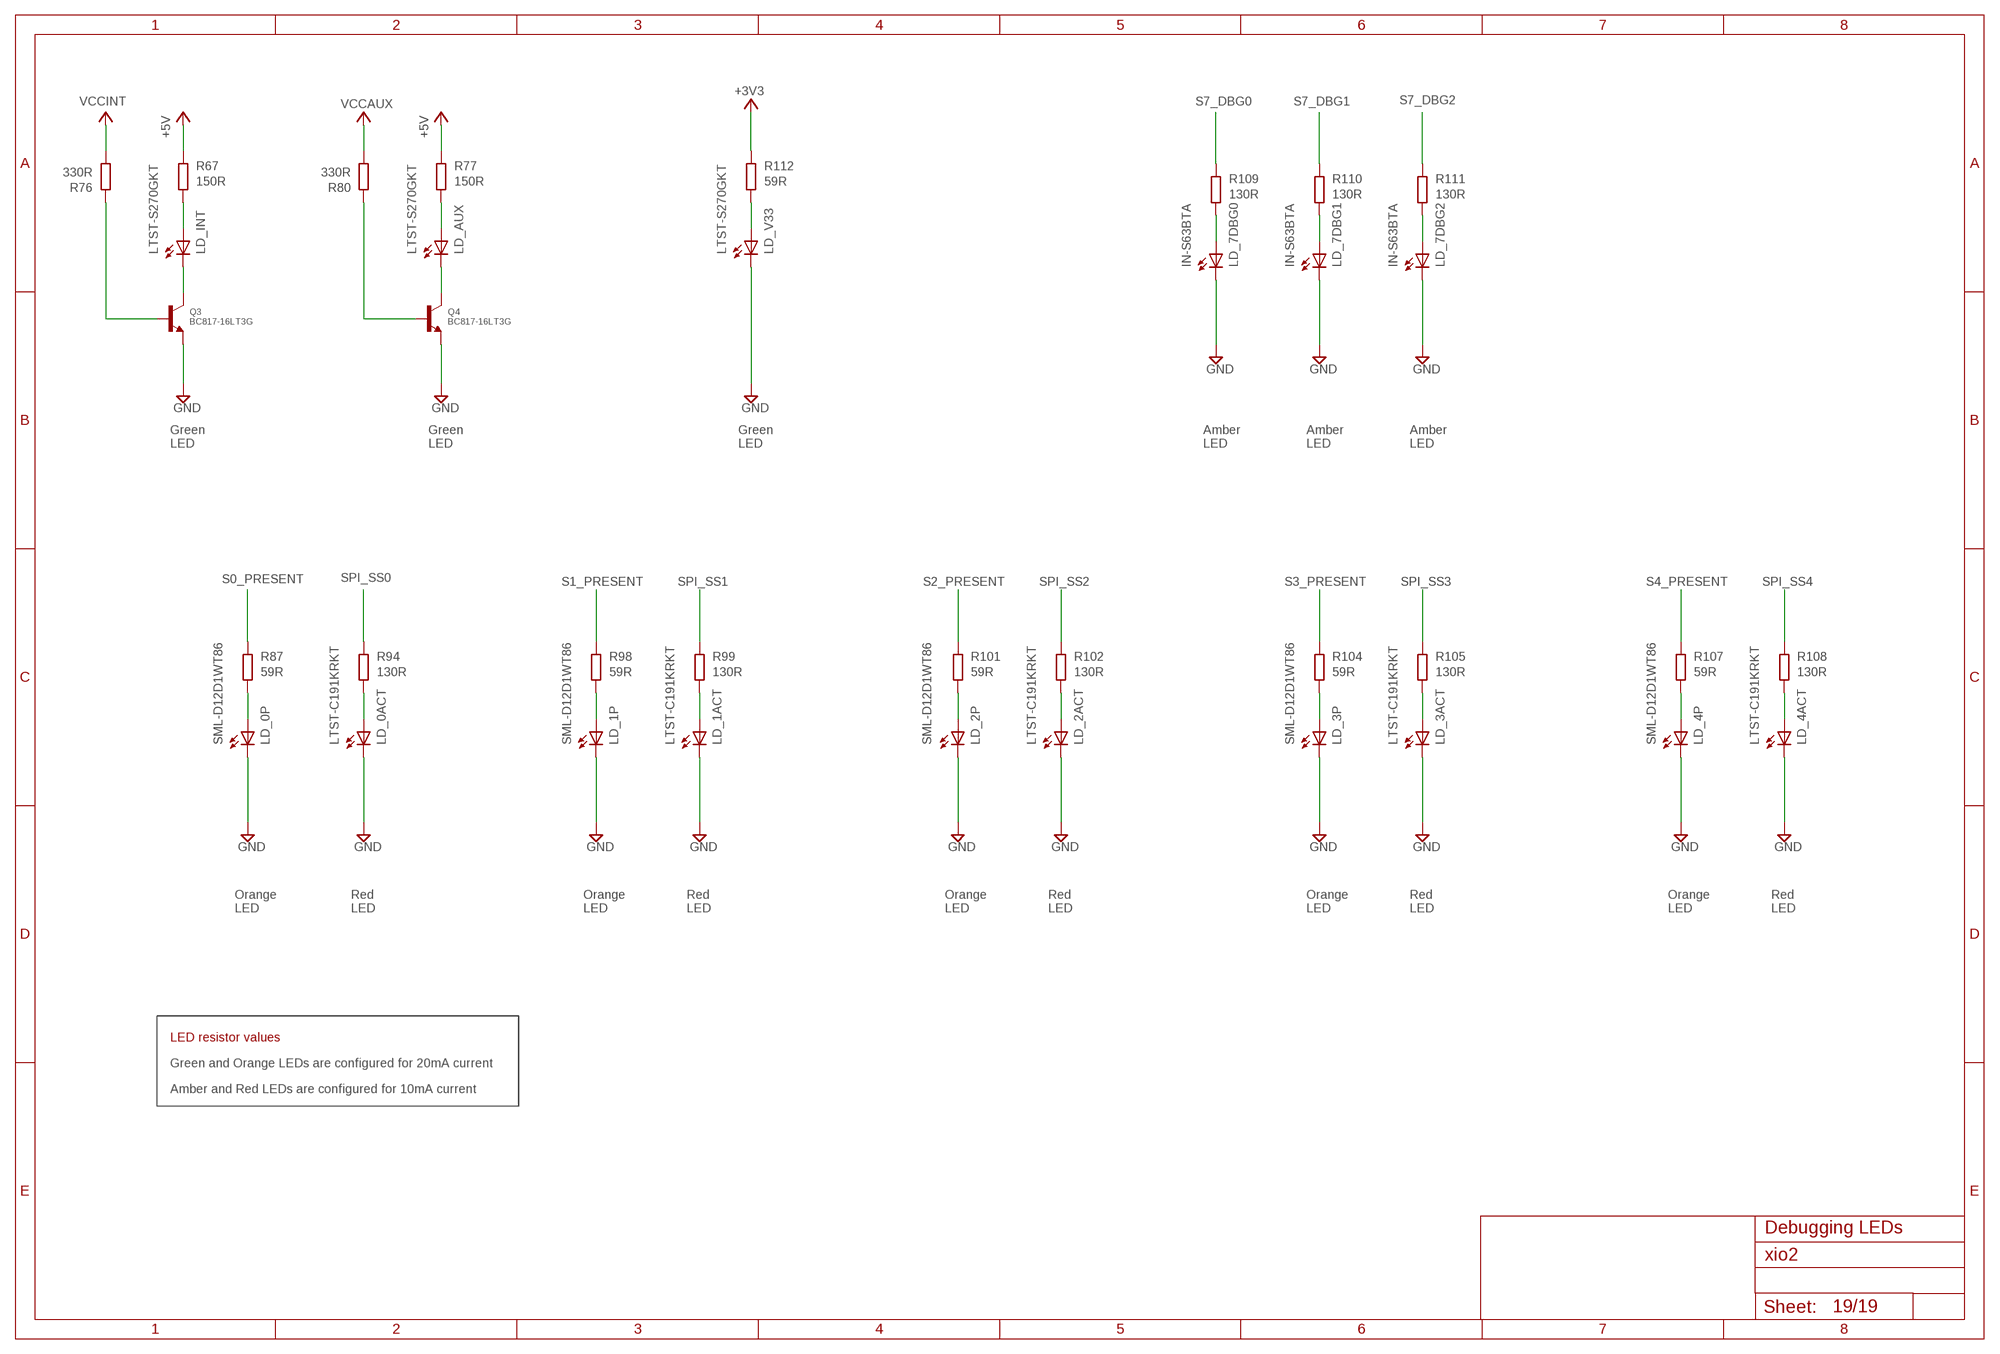
[diagram p18: schematic, sheet 19]

### Parts
LD_0ACT  LTST-C191KRKT  LEDCHIPLED_0603  [CHIPLED_0603]
LD_0P  SML-D12D1WT86  LEDCHIPLED_0603  [CHIPLED_0603]
LD_1ACT  LTST-C191KRKT  LEDCHIPLED_0603  [CHIPLED_0603]
LD_1P  SML-D12D1WT86  LEDCHIPLED_0603  [CHIPLED_0603]
LD_2ACT  LTST-C191KRKT  LEDCHIPLED_0603  [CHIPLED_0603]
LD_2P  SML-D12D1WT86  LEDCHIPLED_0603  [CHIPLED_0603]
LD_3ACT  LTST-C191KRKT  LEDCHIPLED_0603  [CHIPLED_0603]
LD_3P  SML-D12D1WT86  LEDCHIPLED_0603  [CHIPLED_0603]
LD_4ACT  LTST-C191KRKT  LEDCHIPLED_0603  [CHIPLED_0603]
LD_4P  SML-D12D1WT86  LEDCHIPLED_0603  [CHIPLED_0603]
LD_7DBG0  IN-S63BTA  LEDCHIPLED_0603  [CHIPLED_0603]
LD_7DBG1  IN-S63BTA  LEDCHIPLED_0603  [CHIPLED_0603]
LD_7DBG2  IN-S63BTA  LEDCHIPLED_0603  [CHIPLED_0603]
LD_AUX  LTST-S270GKT  LEDCHIPLED_0603  [CHIPLED_0603]
LD_INT  LTST-S270GKT  LEDCHIPLED_0603  [CHIPLED_0603]
LD_V33  LTST-S270GKT  LEDCHIPLED_0603  [CHIPLED_0603]
Q3  BC817-16LT3G  TRANSISTOR_NPN  [SOT23-R]
Q4  BC817-16LT3G  TRANSISTOR_NPN  [SOT23-R]
R67  150R  R-EU_R0402  [R0402]
R76  330R  R-EU_R0402  [R0402]
R77  150R  R-EU_R0402  [R0402]
R80  330R  R-EU_R0402  [R0402]
R87  59R  R-EU_R0402  [R0402]
R94  130R  R-EU_R0402  [R0402]
R98  59R  R-EU_R0402  [R0402]
R99  130R  R-EU_R0402  [R0402]
R101  59R  R-EU_R0402  [R0402]
R102  130R  R-EU_R0402  [R0402]
R104  59R  R-EU_R0402  [R0402]
R105  130R  R-EU_R0402  [R0402]
R107  59R  R-EU_R0402  [R0402]
R108  130R  R-EU_R0402  [R0402]
R109  130R  R-EU_R0402  [R0402]
R110  130R  R-EU_R0402  [R0402]
R111  130R  R-EU_R0402  [R0402]
R112  59R  R-EU_R0402  [R0402]

### Nets
+3V3 [lcd]: R112.1 ; also sheet 2,4,5,6,7,9,10,11,12,13,14,15,16,17,18
+5V [Power]: R67.1 R77.1 ; also sheet 2,7,8,9,10,11,12,13,18
GND: LD_0ACT.C LD_0P.C LD_1ACT.C LD_1P.C LD_2ACT.C LD_2P.C LD_3ACT.C LD_3P.C LD_4ACT.C LD_4P.C LD_7DBG0.C LD_7DBG1.C LD_7DBG2.C LD_V33.C Q3.2(E) Q4.2(E) ; also sheet 2,4,5,6,7,8,9,10,11,12,13,14,15,16,17,18
N$76: LD_INT.A R67.2
N$78: Q3.1(B) R76.1
N$80: LD_INT.C Q3.3(C)
N$81: LD_AUX.A R77.2
N$82: LD_0P.A R87.2
N$84: LD_0ACT.A R94.2
N$85: Q4.1(B) R80.1
N$86: LD_AUX.C Q4.3(C)
N$91: LD_1P.A R98.2
N$92: LD_1ACT.A R99.2
N$94: LD_2P.A R101.2
N$95: LD_2ACT.A R102.2
N$97: LD_3P.A R104.2
N$99: LD_3ACT.A R105.2
N$101: LD_4P.A R107.2
N$102: LD_4ACT.A R108.2
N$103: LD_7DBG0.A R109.2
N$104: LD_7DBG1.A R110.2
N$105: LD_7DBG2.A R111.2
N$106: LD_V33.A R112.2
S0_PRESENT: R87.1 ; also sheet 6,10
S1_PRESENT: R98.1 ; also sheet 6,10
S2_PRESENT: R101.1 ; also sheet 6,11
S3_PRESENT: R104.1 ; also sheet 6,11
S4_PRESENT: R107.1 ; also sheet 6,12
S7_DBG0: R109.1 ; also sheet 17
S7_DBG1: R110.1 ; also sheet 17
S7_DBG2: R111.1 ; also sheet 17
SPI_SS0 [spi]: R94.1 ; also sheet 3,10
SPI_SS1 [spi]: R99.1 ; also sheet 3,10
SPI_SS2 [spi]: R102.1 ; also sheet 3,11
SPI_SS3 [spi]: R105.1 ; also sheet 3,11
SPI_SS4 [spi]: R108.1 ; also sheet 3,12
VCCAUX [vccint_aux]: R80.2 ; also sheet 13,14,15
VCCINT [vccint_aux]: R76.2 ; also sheet 13,14

### Notes on the sheet
- Green
  LED
- Green
  LED
- Green
  LED
- Amber
  LED
- Amber
  LED
- Amber
  LED
- Orange
  LED
- Red
  LED
- Orange
  LED
- Red
  LED
- Orange
  LED
- Red
  LED
- Orange
  LED
- Red
  LED
- Orange
  LED
- Red
  LED
- LED resistor values
- Green and Orange LEDs are configured for 20mA current
- Amber and Red LEDs are configured for 10mA current
- Debugging LEDs

## Library data of the parts
A_MUX = sjg-logic:TS3A27518E; USE: TS3A27518EPWR
ADV7125 = sjg-analog:ADV7125; USE: ADV7125BCPZ170
ARCH_ID = special:SW_DIP-4: DIP SWITCH; USE: 209-4MS
BOOT_MODE PID = special:SW_DIP-3: DIP SWITCH; USE: 209-3MS
C1 C34 C43 = rcl:C-EU: CAPACITOR, European symbol; SPICEPREFIX: C; USE: GRM155C80J106ME11D
C2-C10 C13 C16 C19-C29 C31-C33 C35 C38-C40 C45 C53-C57 C60-C72 C80 C81 C87-C92 C94 C96 C98 C100 C106 C113-C134 C137 C138 C167-C172 = rcl:C-EU: CAPACITOR, European symbol; SPICEPREFIX: C; USE: GRM033C71C104KE14D
C11 C139-C141 = rcl:C-EU: CAPACITOR, European symbol; SPICEPREFIX: C; USE: C2012X6S1C106K085AC
C12 C41 C109 C110 = rcl:C-EU: CAPACITOR, European symbol; SPICEPREFIX: C; USE: CL21A226MOCLRNC
C14 C15 = rcl:C-EU: CAPACITOR, European symbol; SPICEPREFIX: C; USE: GRM0335C1H160JA01D
C17 C18 C99 = rcl:C-EU: CAPACITOR, European symbol; SPICEPREFIX: C; USE: GRM033R60J225ME47D
C30 C36 C47-C51 C58 C83-C86 C104 = rcl:C-EU: CAPACITOR, European symbol; SPICEPREFIX: C; USE: GRM033R60J474ME90D
C37 C44 C93 C136 = rcl:C-EU: CAPACITOR, European symbol; SPICEPREFIX: C; USE: CC0201KRX5R8BB103
C42 C46 C97 C173 = rcl:C-EU: CAPACITOR, European symbol; SPICEPREFIX: C; USE: CL03A105MO3NRNH
C52 = rcl:C-EU: CAPACITOR, European symbol; SPICEPREFIX: C; USE: GRM21BR60J476ME15L
C59 C74-C76 C78 C79 C82 C102 = rcl:C-EU: CAPACITOR, European symbol; SPICEPREFIX: C; USE: GRM155R60J475ME87D
C73 C77 C101 = rcl:C-EU: CAPACITOR, European symbol; SPICEPREFIX: C; USE: GRM21BR60J107ME15L
C108 = rcl:C-EU: CAPACITOR, European symbol; SPICEPREFIX: C; USE: GRM155R61A475MEAAD
C111 = rcl:C-EU: CAPACITOR, European symbol; SPICEPREFIX: C; USE: CL05B103KP5NNNC
C112 = rcl:C-EU: CAPACITOR, European symbol; SPICEPREFIX: C; USE: CL05B392KB5NNNC
C135 = rcl:C-EU: CAPACITOR, European symbol; SPICEPREFIX: C; USE: GRM0335C1H121JA01D
C142 = rcl:C-EU: CAPACITOR, European symbol; SPICEPREFIX: C; USE: GRM155R61C104KA88D
C143 = rcl:C-EU: CAPACITOR, European symbol; SPICEPREFIX: C; USE: C1608C0G1H122K080AA
C144 = rcl:C-EU: CAPACITOR, European symbol; SPICEPREFIX: C; USE: CL21C130JBANNNC
C145 = rcl:C-EU: CAPACITOR, European symbol; SPICEPREFIX: C; USE: CL05C561JB5NNNC
C146 = rcl:C-EU: CAPACITOR, European symbol; SPICEPREFIX: C; USE: C2012X5R1A336M125AC
C177 = rcl:C-EU: CAPACITOR, European symbol; SPICEPREFIX: C; USE: GRM035R60J475ME15D
CARTRIDGE = sjg-con:A8_CART; USE: 5650118-1
D1 D2 = diode:BAT54S: Schottky Diodes Pin connection corrected 2011-05-04 Source: Fairchild .. BAT54.pdf; USE: BAT54SFILMY
DBG0 DBG1 DBG2 = microbuilder:LED: LED; USE: LTST-C191KFKT
EXP_POWER PEXT_10 PEXT_18 = pinhead:PINHD-1X2: PIN HEADER; NOSTUFF: true
EXPANSION = pinhead:PINHD-2X6: PIN HEADER; NOSTUFF: true
FPGA_1_0 = sjg-power:TLV62095; USE: TLV62095RGTR
FPGA_CFG = microbuilder:SPIFLASH_SOIC8: SOIC8 SPI Flash Be careful with the size since SOIC8 flash comes in several 'widths' SOIC8 150 mil M25P16 - 16Mbit (2Mbit x 8) Serial Flash (75MHz SPI Bus), Supply: 2.7-3.6V Digikey: SOIC8 - M25P16-VMN6P-ND SOIC8 208 mil W25Q16BVSSIG - 16Mbit (2Mbit x 8) Serial Flash (104MHz SPI Bus), Supply: 2.7-3.6V Digikey: SOIC8 - W25Q16BVSSIG-ND; USE: MT25QU128ABA1ESE-0SIT TR
FPGA_DONE = microbuilder:LED: LED; USE: SML-D12D1WT86
FPGA_PROG = sjg-con:XILINX-JTAG; USE: SBH21-NBPN-D07-ST-BK
H1 H2 H4 H5 = holes:MOUNT-HOLE: MOUNTING HOLE with drill center marker; NOSTUFF: true
HOST_IO = pinhead:PINHD-2X20: PIN HEADER; NOSTUFF: true
IO_EXP = sjg-logic:MCP23S17T-E/SS; USE: MCP23S17T-E/SS
J1 = usb-c:12401598E4#2A: Usb Jack 3.1, C Type, 24 Pin, Ho; AVAILABILITY: Unavailable; DESCRIPTION: Usb Type C / Tape & Reel; MF: Amphenol Commercial; MP: 12401598E4#2A; PACKAGE: None; PRICE: None; USE: 12401598E4#2A
L1 = rcl:L-EU: INDUCTOR, European symbol; SPICEPREFIX: L; USE: ASPI-0530LR-1R5M-T2
L2 = sjg-inductor:PA4332; USE: PA4332.222NLT
L3 = sjg-power:DFE18SANR47MG0L; USE: DFE18SANR47MG0L
LD_0ACT LD_1ACT LD_2ACT LD_3ACT LD_4ACT = led:LED: LED; USE: 150060RS75000
LD_0P LD_1P LD_2P LD_3P LD_4P = led:LED: LED; USE: SML-D12D1WT86
LD_7DBG0 LD_7DBG1 LD_7DBG2 = led:LED: LED; USE: ASMT-RA45-AP932
LD_AUX LD_INT LD_V33 = led:LED: LED; USE: LTST-S270GKT
LVL_AHI LVL_ALO LVL_D = sjg-logic:SN74LVC8T245; USE: SN74LVC8T245PWR
MEM_ID = special:SW_DIP-2: DIP SWITCH; USE: 209-2MS
MUX-HI MUX-LO = sjg-logic:IDTQS3VH257; USE: QS3VH257S1G
OSC1 = microbuilder:OSCILLATOR: Oscillators 3.2x2.5mm SMT 4.0MHz +/- 50ppm, 3.3V, 9mA, -40/+85°C - Digikey: 535-9752-1-ND 50MHz +/- 50ppm, 3.3V, 8mA, -10/+70°C - Digikey: 478-4792-1-ND 5x7mm SMT 4.0MHz +/-20ppm 3.3V, 20mA, -20/+70°C - Digikey: 535-9329-2-ND 50MHz +/- 25ppm 3.3V, 35mA, -40/+85°C - Digikey: 631-1197-1-ND; USE: SIT8008BI-23-33S-50.000000G
PEXT_33 = pinhead:PINHD-2X2: PIN HEADER; NOSTUFF: true
POWER = sjg-power:CONN-POWER-JACK-2.1MM(DC-005): 320120003; MPN: DC-005; USE: PJ-102AH; VALUE: DC-005
PSW = sjg-power:NCP380; USE: NCP380HSNAJAAT1G
Q1 Q2 = transistor-small-signal:BSS123: N-CHANNEL MOS FET; USE: BSS138
Q3 Q4 = microbuilder:TRANSISTOR_NPN: NPN Transistor Transistor (NPN) 500mA 45V - BC817 [Digikey: 568-1631-1-ND] Transistor (NPN) 500mA 45V - BC817,215 [Mouser: 771-BC817-T/R] SOT23-R - SOT23 footprint optimised for use with solder paste and reflow ovens. SOT23-W - SOT23 footprint optimised for hand-soldering (larger pads).; USE: BC817-16LT3G
R1 R24 R53 R72 = rcl:R-EU_: RESISTOR, European symbol; SPICEPREFIX: R; USE: RC0201JR-070RL
R2-R4 R94 R99 R102 R105 R108-R111 = rcl:R-EU_: RESISTOR, European symbol; SPICEPREFIX: R; USE: RMCF0402JT130R
R5 R81 = rcl:R-EU_: RESISTOR, European symbol; NOSTUFF: TRUE; SPICEPREFIX: R
R6-R9 R14-R18 R125-R127 = rcl:R-EU_: RESISTOR, European symbol; SPICEPREFIX: R; USE: RMCF0201JT47K0
R10 = rcl:R-EU_: RESISTOR, European symbol; SPICEPREFIX: R; USE: RC0201FR-07560RL
R11-R13 R50 R51 R58 R122-R124 R128 = rcl:R-EU_: RESISTOR, European symbol; SPICEPREFIX: R; USE: RC0201JR-071KL
R19 R20 R22 = rcl:R-EU_: RESISTOR, European symbol; SPICEPREFIX: R; USE: RC0201FR-0775RL
R21 R26 R27 R52 R60 R73-R75 R91-R93 = rcl:R-EU_: RESISTOR, European symbol; SPICEPREFIX: R; USE: RMCF0201JT33R0
R23 R69-R71 R78 R79 = rcl:R-EU_: RESISTOR, European symbol; SPICEPREFIX: R; USE: RC0603J472CS
R36-R41 = rcl:R-EU_: RESISTOR, European symbol; SPICEPREFIX: R; USE: RC0402JR-0747KL
R54 R55 R57 = rcl:R-EU_: RESISTOR, European symbol; SPICEPREFIX: R; USE: RC0603F242CS
R56 = rcl:R-EU_: RESISTOR, European symbol; SPICEPREFIX: R; USE: CRCW04021M00FKED
R59 R61-R65 R82-R85 R88-R90 R120 R121 = rcl:R-EU_: RESISTOR, European symbol; SPICEPREFIX: R; USE: ERJ-1GNJ103C
R66 = rcl:R-EU_: RESISTOR, European symbol; SPICEPREFIX: R; USE: ERJ-1GNJ201C
R67 R77 = rcl:R-EU_: RESISTOR, European symbol; SPICEPREFIX: R; USE: RMCF0402JT150R
R68 = rcl:R-EU_: RESISTOR, European symbol; SPICEPREFIX: R; USE: ERJ-2GEJ101X
R76 R80 = rcl:R-EU_: RESISTOR, European symbol; SPICEPREFIX: R; USE: RMCF0402JT330R
R87 R98 R101 R104 R107 R112 = rcl:R-EU_: RESISTOR, European symbol; SPICEPREFIX: R; USE: RMCF0402FT59R0
R113-R118 = rcl:R-EU_: RESISTOR, European symbol; SPICEPREFIX: R; USE: CRCW020149R9FNED
R119 = rcl:R-EU_: RESISTOR, European symbol; SPICEPREFIX: R; USE: RMCF0201JT100K
R129 = rcl:R-EU_: RESISTOR, European symbol; SPICEPREFIX: R; USE: ERJ-2RKF4993X
R130 = rcl:R-EU_: RESISTOR, European symbol; SPICEPREFIX: R; USE: RMCF0402FT40K2
R131 = rcl:R-EU_: RESISTOR, European symbol; SPICEPREFIX: R; USE: RMCF0402JT160K
R133 = rcl:R-EU_: RESISTOR, European symbol; SPICEPREFIX: R; USE: CRCW040210R5FKED
R134 = rcl:R-EU_: RESISTOR, European symbol; SPICEPREFIX: R; USE: CRCW040248K7FKED
R135 = rcl:R-EU_: RESISTOR, European symbol; SPICEPREFIX: R; USE: ERJ-6ENF6041V
R136 = rcl:R-EU_: RESISTOR, European symbol; SPICEPREFIX: R; USE: RR1220P-123-D
R137 = rcl:R-EU_: RESISTOR, European symbol; SPICEPREFIX: R; USE: CRCW04022K67FKED
R138 = rcl:R-EU_: RESISTOR, European symbol; SPICEPREFIX: R; USE: CRCW040264R9FKED
R139 = rcl:R-EU_: RESISTOR, European symbol; SPICEPREFIX: R; USE: RC0201FR-07105KL
RESET_S7 RESET_XIO = SparkFun:TAC_SWITCH: Momentary Switch Button commonly used for reset or general input. Spark Fun Electronics SKU : COM-00097; USE: 1825910-6
SD_SLOT = j_microsd_molex_5025700893:MICROSD_MOLEX_5025700893: Molex 5025700893 MicroSD Normal Mount SMT Connector; USE: 5025700893
SDRAM = sjg-sdram:IS42S32160F-7TLI; USE: IS42S32160F-7TLI
SERIAL0 = SparkFun:DB9: DB9 Connector Standard DB9 (D-Sub 9) serial connector. Can be used for CAN bus as well as RS485 and RS232. Footprint production proven. Spark Fun Electronics SKU : PRT-00429; USE: D09P33E4GX00LF
SERIAL_BUF0 = maxim:MAX3232*: True RS-232 Transceivers 3.0V to 5.5V, Low-Power up to 1Mbps, Using Four 0.1µF External Capacitors Source: http://pdfserv.maxim-ic.com/en/ds/MAX3222-MAX3241.pdf; MPN: MAX3232CSE; OC_FARNELL: 9725490; OC_NEWARK: 90C2890; USE: MAX3232ECDR
SLOT0 SLOT1-SLOT4 = pcie:PCIE_64; USE: 10018783-10201TLF
SPI_DBG = pinhead:PINHD-1X5: PIN HEADER; NOSTUFF: true
U$5-U$8 = sjg-logic:74LVC1T45GW; USE: 74LVCH1T45GS,132
USB = con-hirose:MINI-USB-: MINI USB Connector Source: http://www.hirose.co.jp/cataloge_hp/e24000019.pdf; OC_FARNELL: unknown; OC_NEWARK: unknown; USE: UX60-MB-5ST
USB_ESD = sjg-isolation:PUSB2X4YH; USE: PUSB2X4YH
VGA = SparkFun-Connectors:DB15: DB15 / VGA right angle through-hole female connector.; USE: ICD15S13E4GX00LF
VREG_18 = sjg-ti:TPS62087RLTR; DATASHEETURL: httpwww.ti.comproducttps62087; FREQUENCY: 100000.0; IMAX: 3.0; MANUFACTURER_NAME: Texas Instruments; MANUFACTURER_PART_NUMBER: TPS62087RLTR; MKTG_PACKAGE: TPS62087; NSID: TPS62087RLTR; PACKAGE: TPS62087; USE: TPS62087RLTR; VENDOR: Texas Instruments
VREG_33 = sjg-power:LM21212; USE: LM21212MHX-2/NOPB
VREG_MON = sjg-power:TPS3808DBVR; USE: TPS3808G33DBVR
VREG_VGA = sjg-analog:AD1580ARTZ; USE: AD1580ARTZ-REEL7
XC7S25 = sjg-xilinx:XC7S25; USE: XC7S25-2FTGB196I
XIO = sjg-stm32:STM32H743-XIO; USE: STM32H743XIH6
XIO-SWD = sjg-stm32:STM_DEBUG; USE: FTSH-105-01-LM-DV-K-P-TR
XSPI5_DBG XSPI6_DBG = pinhead:PINHD-1X3: PIN HEADER; NOSTUFF: TRUE
Y2 = microbuilder:CRYSTAL: Crystals HC49UP - Surface Mount Crystal 4.0MHz 18pF +/-30ppm Surface Mount Crystal [Digikey: 535-9857-1-ND] 12.0 MHz Surface Mount Crystal [Digikey: 535-9869-6-ND] 25.0 MHz Surface Mount Crystal [Digikey: 535-9078-1-ND] 2.5 x 2.0mm - MEMs SMT Crystal 16.0 MHz 10pF 20ppm 2.5 x 2.0mm Crystal [Digikey -40-85°C: 535-10923-1-ND] 3.2 x 2.5mm - MEMs SMT Crystal 12.0 MHz 8pF 15ppm 3.2 x 2.5mm Crystal [Digikey: -10-70°C: 644-1047-1-ND -40-125°C: 644-1128-1-ND] 16.0 MHz 8pF 15ppm 3.2 x 2.5mm Crystal [Digikey: -10-70°C: 644-1049-1-ND -40-125°C: 644-1129-2-ND] 16.0 MHz 10pF 10ppm 3.2 x 2.5mm Crystal [Digikey: 644-1100-1-ND] 27.12 MHz 18pF 30ppm 3.2 x 2.5mm Crystal [Digikey: 887-1424-1-ND] 27.12MHz 10pF 10ppm 3.2 x 2.5mm Crystal [Digikey: 887-1329-1-ND] 4.9 x 1.8mm - MEMs SMT Crystal 32.768 KHz 12.5pF 20ppm 4.9 x 1.8mm Crystal [Digikey: SE2415CT-ND] 8.0 x 3.8mm - Surface Mount Crystal 32.768kHz 12.5pF 20ppm -40°C-85°C [Digikey: 535-9166-2-ND] Cylinder 32.768KHz Cylinder Crystal (2x6mm body) [Ex. Digikey: 300-8341-2-ND]; USE: FA-238 25.0000MB-K3

## Net classes
1 Power: width 0.305 mm, drill 0.203 mm
2 Slot-power: width 0.508 mm
3 tx100: width 0.254 mm, clearance 0.457 mm
4 usb90: width 0.254 mm, clearance 0.178 mm
5 cclk50: width 0.203 mm
6 3v3: width 0.254 mm
7 vccint_aux: width 0.305 mm
14 qspi: width 0.203 mm